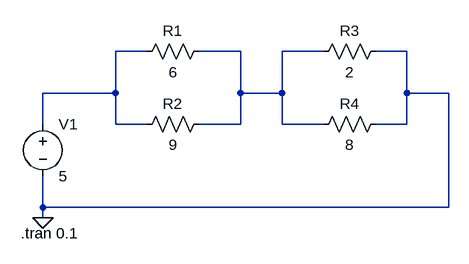
[diagram p0: schematic exam question 2.asc]
exam question 2.asc, the LTspice schematic file:
Version 4
SHEET 1 880 680
WIRE 64 128 16 128
WIRE 208 128 144 128
WIRE 336 128 272 128
WIRE 464 128 416 128
WIRE 16 192 16 128
WIRE 16 192 -96 192
WIRE 208 192 208 128
WIRE 272 192 272 128
WIRE 272 192 208 192
WIRE 464 192 464 128
WIRE 528 192 464 192
WIRE -96 240 -96 192
WIRE 16 240 16 192
WIRE 64 240 16 240
WIRE 208 240 208 192
WIRE 208 240 144 240
WIRE 272 240 272 192
WIRE 336 240 272 240
WIRE 464 240 464 192
WIRE 464 240 416 240
WIRE -96 368 -96 320
WIRE 528 368 528 192
WIRE 528 368 -96 368
WIRE -96 384 -96 368
FLAG -96 384 0
SYMBOL res 160 112 R90
WINDOW 0 0 56 VBottom 2
WINDOW 3 32 56 VTop 2
SYMATTR InstName R1
SYMATTR Value 6
SYMBOL res 160 224 R90
WINDOW 0 0 56 VBottom 2
WINDOW 3 32 56 VTop 2
SYMATTR InstName R2
SYMATTR Value 9
SYMBOL res 432 112 R90
WINDOW 0 0 56 VBottom 2
WINDOW 3 32 56 VTop 2
SYMATTR InstName R3
SYMATTR Value 2
SYMBOL res 432 224 R90
WINDOW 0 0 56 VBottom 2
WINDOW 3 32 56 VTop 2
SYMATTR InstName R4
SYMATTR Value 8
SYMBOL voltage -96 224 R0
WINDOW 123 0 0 Left 2
WINDOW 39 0 0 Left 2
SYMATTR InstName V1
SYMATTR Value 5
TEXT -130 408 Left 2 !.tran 0.1

The netlist it stands for:
* exam question 2.asc
R1 N002 N001 6
R2 N002 N001 9
R3 0 N002 2
R4 0 N002 8
V1 N001 0 5
.tran 0.1
.backanno
.end